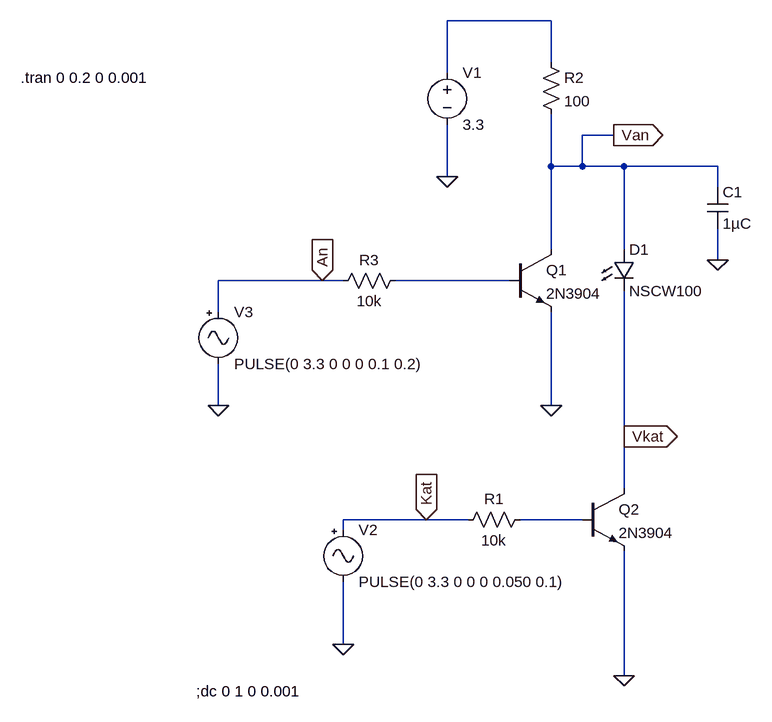
[diagram p0: schematic led_matrix_driver_v2.asc]
led_matrix_driver_v2.asc, the LTspice schematic file:
Version 4
SHEET 1 880 680
WIRE -144 -624 -304 -624
WIRE -144 -560 -144 -624
WIRE -304 -544 -304 -624
WIRE -48 -448 -96 -448
WIRE -144 -400 -144 -480
WIRE -96 -400 -96 -448
WIRE -96 -400 -144 -400
WIRE -32 -400 -96 -400
WIRE 112 -400 -32 -400
WIRE -304 -384 -304 -464
WIRE 112 -368 112 -400
WIRE -144 -272 -144 -400
WIRE -32 -272 -32 -400
WIRE 112 -256 112 -304
WIRE -496 -224 -656 -224
WIRE -464 -224 -496 -224
WIRE -208 -224 -384 -224
WIRE -656 -176 -656 -224
WIRE -656 -32 -656 -96
WIRE -144 -32 -144 -176
WIRE -32 16 -32 -208
WIRE -32 96 -32 16
WIRE -336 144 -464 144
WIRE -272 144 -336 144
WIRE -96 144 -192 144
WIRE -464 160 -464 144
WIRE -464 336 -464 240
WIRE -32 384 -32 192
FLAG -32 384 0
FLAG -144 -32 0
FLAG -336 144 Kat
IOPIN -336 144 In
FLAG -496 -224 An
IOPIN -496 -224 In
FLAG -48 -448 Van
IOPIN -48 -448 Out
FLAG -304 -384 0
FLAG -656 -32 0
FLAG -464 336 0
FLAG -32 16 Vkat
IOPIN -32 16 Out
FLAG 112 -256 0
SYMBOL res -176 128 R90
WINDOW 0 0 56 VBottom 2
WINDOW 3 32 56 VTop 2
SYMATTR InstName R1
SYMATTR Value 10k
SYMBOL res -160 -576 R0
SYMATTR InstName R2
SYMATTR Value 100
SYMBOL res -368 -240 R90
WINDOW 0 0 56 VBottom 2
WINDOW 3 32 56 VTop 2
SYMATTR InstName R3
SYMATTR Value 10k
SYMBOL npn -208 -272 R0
SYMATTR InstName Q1
SYMATTR Value 2N3904
SYMBOL npn -96 96 R0
SYMATTR InstName Q2
SYMATTR Value 2N3904
SYMBOL LED -48 -272 R0
SYMATTR InstName D1
SYMATTR Value NSCW100
SYMBOL voltage -304 -560 R0
WINDOW 123 0 0 Left 0
WINDOW 39 0 0 Left 0
SYMATTR InstName V1
SYMATTR Value 3.3
SYMBOL Misc\\signal -464 144 R0
WINDOW 123 0 0 Left 0
WINDOW 39 0 0 Left 0
SYMATTR InstName V2
SYMATTR Value PULSE(0 3.3 0 0 0 0.050 0.1)
SYMBOL Misc\\signal -656 -192 R0
WINDOW 123 0 0 Left 0
WINDOW 39 0 0 Left 0
SYMATTR InstName V3
SYMATTR Value PULSE(0 3.3 0 0 0 0.1 0.2)
SYMBOL cap 96 -368 R0
SYMATTR InstName C1
SYMATTR Value 1µC
TEXT -690 408 Left 2 !;dc 0 1 0 0.001
TEXT -960 -536 Left 2 !.tran 0 0.2 0 0.001

The netlist it stands for:
* led_matrix_driver_v2.asc
R1 N003 Kat 10k
R2 N001 Van 100
R3 N002 An 10k
Q1 Van N002 0 0 2N3904
Q2 Vkat N003 0 0 2N3904
D1 Van Vkat NSCW100
V1 N001 0 3.3
V2 Kat 0 PULSE(0 3.3 0 0 0 0.050 0.1)
V3 An 0 PULSE(0 3.3 0 0 0 0.1 0.2)
C1 Van 0 1µC
.model D D
.lib standard.dio
.model NPN NPN
.model PNP PNP
.lib standard.bjt
;dc 0 1 0 0.001
.tran 0 0.2 0 0.001
.backanno
.end

* Results of the author's LTspice run, read from the files saved beside the schematic
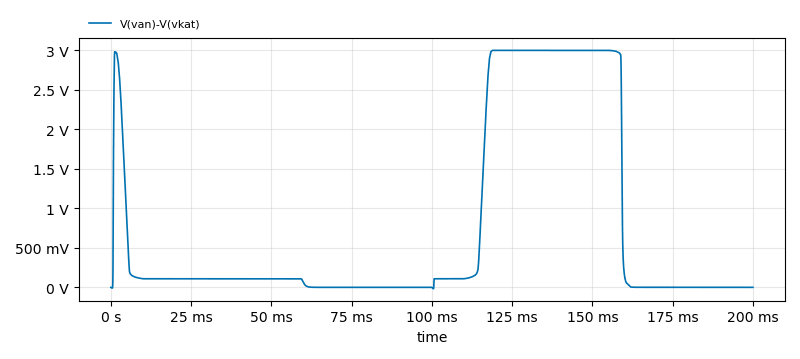
[diagram p1: Transient Analysis of led_matrix_driver_v2.asc, plotted from the saved traces]
* Transient Analysis, 1 run:
*   V(van)-V(vkat): min -18.45 mV, max 3 V, average 736.4 mV, rms 1.425 V, last 48.88 µV